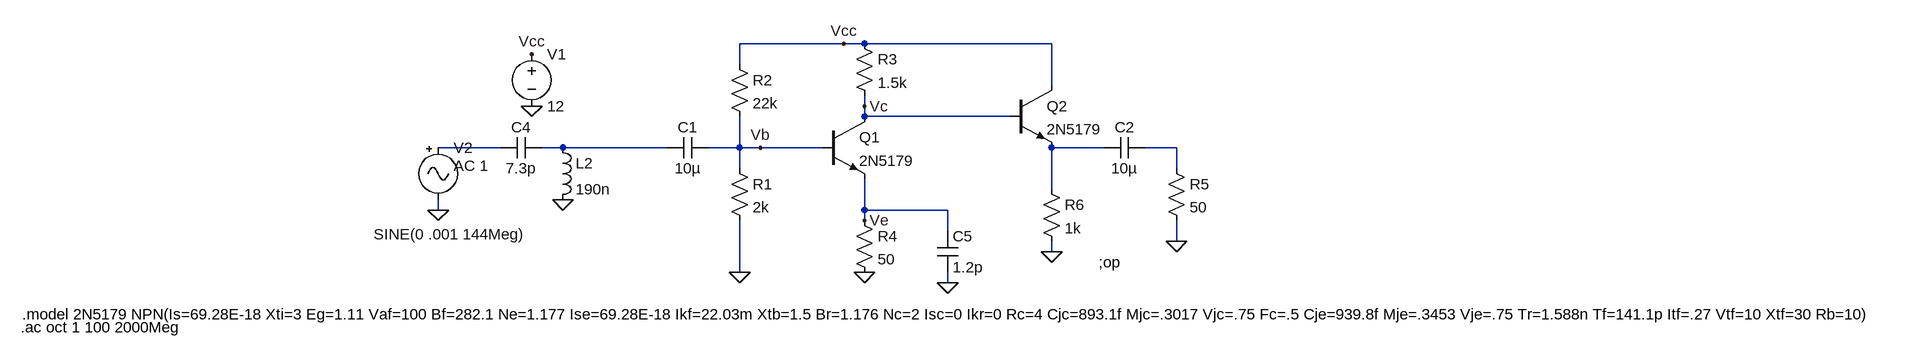
[diagram p0: schematic CE-CC.asc]
CE-CC.asc, the LTspice schematic file:
Version 4
SHEET 1 880 680
WIRE -1424 -720 -1584 -720
WIRE -1392 -720 -1424 -720
WIRE -1104 -720 -1392 -720
WIRE -1584 -688 -1584 -720
WIRE -1104 -656 -1104 -720
WIRE -1392 -624 -1392 -640
WIRE -1392 -608 -1392 -624
WIRE -1168 -608 -1392 -608
WIRE -1952 -560 -2048 -560
WIRE -1856 -560 -1888 -560
WIRE -1696 -560 -1856 -560
WIRE -1584 -560 -1584 -608
WIRE -1584 -560 -1632 -560
WIRE -1552 -560 -1584 -560
WIRE -1456 -560 -1552 -560
WIRE -1024 -560 -1104 -560
WIRE -912 -560 -960 -560
WIRE -1584 -528 -1584 -560
WIRE -912 -528 -912 -560
WIRE -1104 -496 -1104 -560
WIRE -2048 -464 -2048 -480
WIRE -1392 -464 -1392 -512
WIRE -1264 -464 -1392 -464
WIRE -1392 -448 -1392 -464
WIRE -1264 -432 -1264 -464
WIRE -912 -416 -912 -448
WIRE -1104 -400 -1104 -416
WIRE -1584 -368 -1584 -448
WIRE -1264 -352 -1264 -368
FLAG -1584 -368 0
FLAG -1392 -368 0
FLAG -1904 -624 0
FLAG -1904 -704 Vcc
FLAG -1424 -720 Vcc
FLAG -912 -416 0
FLAG -2048 -464 0
FLAG -1392 -624 Vc
FLAG -1552 -560 Vb
FLAG -1856 -480 0
FLAG -1392 -448 Ve
FLAG -1264 -352 0
FLAG -1104 -400 0
SYMBOL res -1600 -544 R0
SYMATTR InstName R1
SYMATTR Value 2k
SYMBOL res -1600 -704 R0
SYMATTR InstName R2
SYMATTR Value 22k
SYMBOL res -1408 -736 R0
SYMATTR InstName R3
SYMATTR Value 1.5k
SYMBOL res -1408 -464 R0
SYMATTR InstName R4
SYMATTR Value 50
SYMBOL npn -1456 -608 R0
SYMATTR InstName Q1
SYMATTR Value 2N5179
SYMBOL voltage -1904 -720 R0
SYMATTR InstName V1
SYMATTR Value 12
SYMBOL cap -1632 -576 R90
WINDOW 0 0 32 VBottom 2
WINDOW 3 32 32 VTop 2
SYMATTR InstName C1
SYMATTR Value 10µ
SYMBOL res -928 -544 R0
SYMATTR InstName R5
SYMATTR Value 50
SYMBOL Misc\\signal -2048 -576 R0
WINDOW 123 24 44 Left 2
WINDOW 39 0 0 Left 2
WINDOW 3 -99 149 Left 2
SYMATTR Value2 AC 1
SYMATTR Value SINE(0 .001 144Meg)
SYMATTR InstName V2
SYMBOL cap -1888 -576 R90
WINDOW 0 0 32 VBottom 2
WINDOW 3 32 32 VTop 2
SYMATTR InstName C4
SYMATTR Value 7.3p
SYMBOL ind -1872 -576 R0
SYMATTR InstName L2
SYMATTR Value 190n
SYMBOL cap -1280 -432 R0
SYMATTR InstName C5
SYMATTR Value 1.2p
SYMBOL npn -1168 -656 R0
SYMATTR InstName Q2
SYMATTR Value 2N5179
SYMBOL res -1120 -512 R0
SYMATTR InstName R6
SYMATTR Value 1k
SYMBOL cap -960 -576 R90
WINDOW 0 0 32 VBottom 2
WINDOW 3 32 32 VTop 2
SYMATTR InstName C2
SYMATTR Value 10µ
TEXT -1032 -384 Left 2 !;op
TEXT -2688 -304 Left 2 !.model 2N5179 NPN(Is=69.28E-18 Xti=3 Eg=1.11 Vaf=100 Bf=282.1 Ne=1.177 Ise=69.28E-18 Ikf=22.03m Xtb=1.5 Br=1.176 Nc=2 Isc=0 Ikr=0 Rc=4 Cjc=893.1f Mjc=.3017 Vjc=.75 Fc=.5 Cje=939.8f Mje=.3453 Vje=.75 Tr=1.588n Tf=141.1p Itf=.27 Vtf=10 Xtf=30 Rb=10)
TEXT -2690 -284 Left 2 !.ac oct 1 100 2000Meg

The netlist it stands for:
* CE-CC.asc
R1 Vb 0 2k
R2 Vcc Vb 22k
R3 Vcc Vc 1.5k
R4 Ve 0 50
Q1 Vc Vb Ve 0 2N5179
V1 Vcc 0 12
C1 Vb N002 10µ
R5 N004 0 50
V2 N001 0 SINE(0 .001 144Meg) AC 1
C4 N002 N001 7.3p
L2 N002 0 190n
C5 Ve 0 1.2p
Q2 Vcc Vc N003 0 2N5179
R6 N003 0 1k
C2 N004 N003 10µ
.model NPN NPN
.model PNP PNP
.lib standard.bjt
;op
.model 2N5179 NPN(Is=69.28E-18 Xti=3 Eg=1.11 Vaf=100 Bf=282.1 Ne=1.177 Ise=69.28E-18 Ikf=22.03m Xtb=1.5 Br=1.176 Nc=2 Isc=0 Ikr=0 Rc=4 Cjc=893.1f Mjc=.3017 Vjc=.75 Fc=.5 Cje=939.8f Mje=.3453 Vje=.75 Tr=1.588n Tf=141.1p Itf=.27 Vtf=10 Xtf=30 Rb=10)
.ac oct 1 100 2000Meg
.backanno
.end